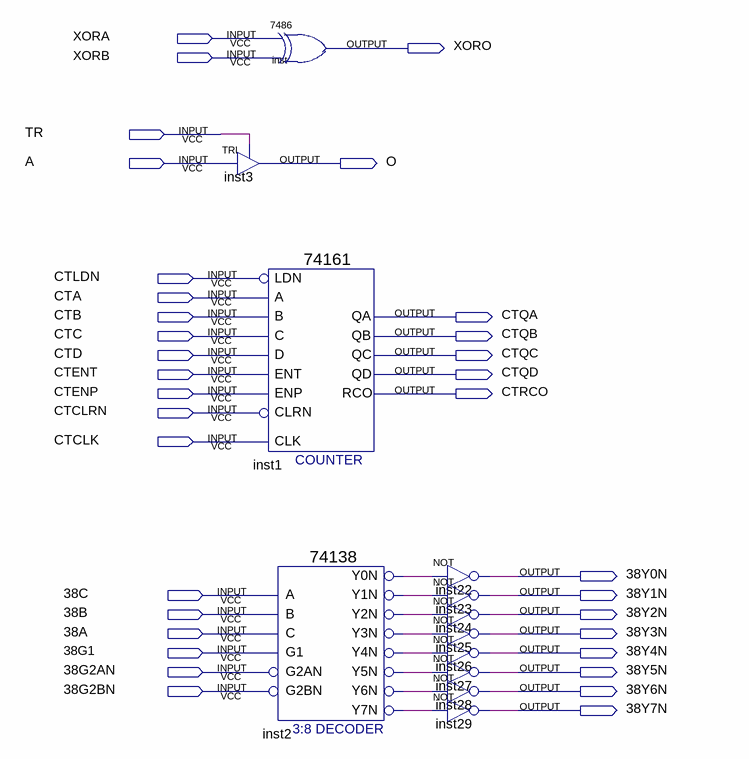
[diagram p0: schematic sheet]
// Quartus schematic COADEXP1.bdf as structural Verilog: 12 symbols, 34 pins
module COADEXP1 (
  input  XORA,
  input  XORB,
  input  TR,
  input  A,
  input  CTLDN,
  input  CTA,
  input  CTB,
  input  CTC,
  input  CTD,
  input  CTENT,
  input  CTENP,
  input  CTCLRN,
  input  CTCLK,
  input  \38C ,
  input  \38B ,
  input  \38A ,
  input  \38G1 ,
  input  \38G2AN ,
  input  \38G2BN ,
  output XORO,
  output O,
  output CTQA,
  output CTQB,
  output CTQC,
  output CTQD,
  output CTRCO,
  output \38Y0N ,
  output \38Y1N ,
  output \38Y2N ,
  output \38Y3N ,
  output \38Y4N ,
  output \38Y5N ,
  output \38Y6N ,
  output \38Y7N 
);

  wire inst2_y0n, inst2_y1n, inst2_y2n, inst2_y3n, inst2_y4n, inst2_y5n, inst2_y6n, inst2_y7n;

  \7486  inst (.\2 (XORA), .\3 (XORB), .\1 (XORO));
  TRI inst3 (.IN(A), .OE(TR), .OUT(O));
  \74161  inst1 (
    .CLRN(CTCLRN), .CLK(CTCLK), .ENP(CTENP), .LDN(CTLDN), .A(CTA), .D(CTD), .ENT(CTENT), .B(CTB), .C(CTC),
    .QD(CTQD), .QC(CTQC), .QB(CTQB), .QA(CTQA), .RCO(CTRCO));
  \74138  inst2 (
    .A(\38C ), .B(\38B ), .G1(\38G1 ), .C(\38A ), .G2AN(\38G2AN ), .G2BN(\38G2BN ), .Y0N(inst2_y0n),
    .Y1N(inst2_y1n), .Y2N(inst2_y2n), .Y3N(inst2_y3n), .Y4N(inst2_y4n), .Y5N(inst2_y5n), .Y6N(inst2_y6n),
    .Y7N(inst2_y7n));
  not inst22 (\38Y0N , inst2_y0n);
  not inst23 (\38Y1N , inst2_y1n);
  not inst24 (\38Y2N , inst2_y2n);
  not inst25 (\38Y3N , inst2_y3n);
  not inst26 (\38Y4N , inst2_y4n);
  not inst27 (\38Y5N , inst2_y5n);
  not inst28 (\38Y6N , inst2_y6n);
  not inst29 (\38Y7N , inst2_y7n);
endmodule
